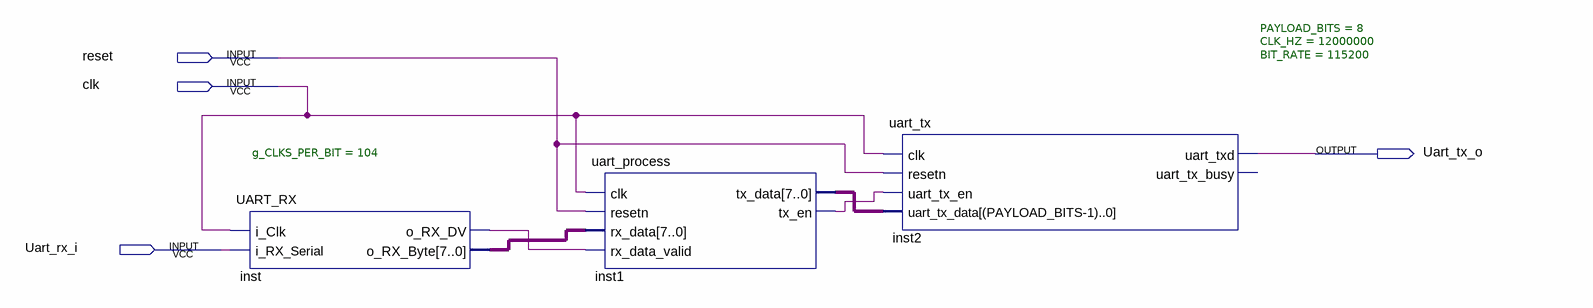
[diagram p0: schematic sheet]
// Quartus schematic test_uart.bdf as structural Verilog: 3 symbols, 4 pins
module test_uart (
  input  reset,
  input  clk,
  input  Uart_rx_i,
  output Uart_tx_o
);

  wire inst1_tx_en, inst_o_rx_dv;
  wire [7:0] inst1_tx_data, inst_o_rx_byte;

  UART_RX #(.g_CLKS_PER_BIT(104)) inst (
    .i_Clk(clk), .i_RX_Serial(Uart_rx_i), .o_RX_DV(inst_o_rx_dv), .o_RX_Byte(inst_o_rx_byte));
  uart_process inst1 (
    .clk(clk), .resetn(reset), .rx_data(inst_o_rx_byte), .rx_data_valid(inst_o_rx_dv),
    .tx_data(inst1_tx_data), .tx_en(inst1_tx_en));
  uart_tx #(.PAYLOAD_BITS(8), .CLK_HZ(12000000), .BIT_RATE(115200)) inst2 (
    .clk(clk), .resetn(reset), .uart_tx_en(inst1_tx_en), .uart_tx_data(inst1_tx_data), .uart_txd(Uart_tx_o));  // open: uart_tx_busy
endmodule
